# Altium project PCB_Project_IGNIS_v2_2.PrjPcb
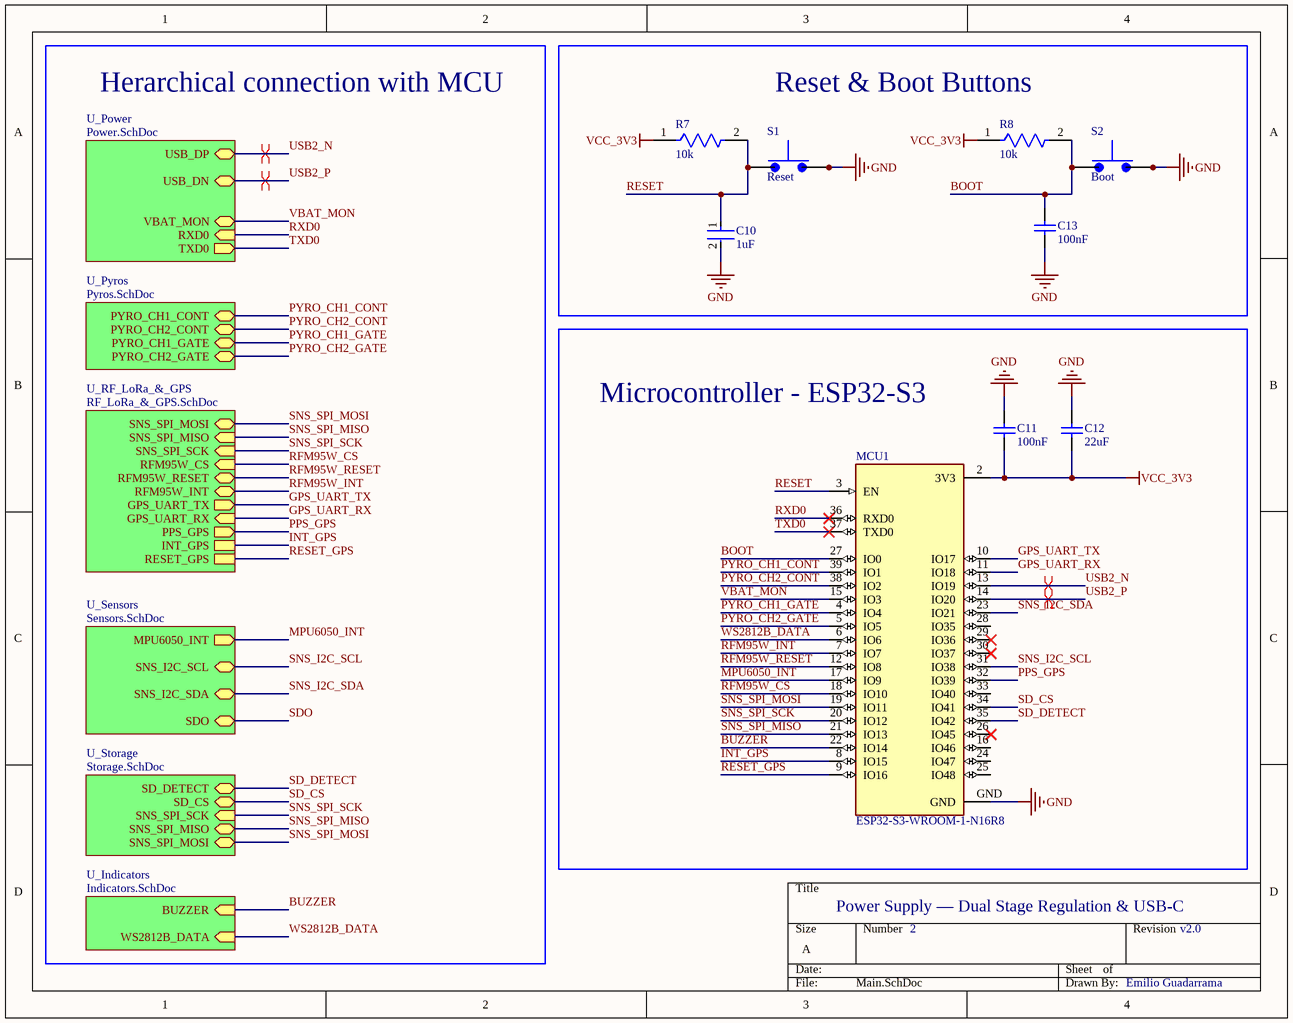
[diagram p0: Main.SchDoc]
7 sheets, 101 parts. Net scope: hierarchical (ports join the sheet entries above them; power ports are global).
Board file: PCB1_IGNIS_v2_2.PcbDoc
Sheets:
  Main.SchDoc
    U_Pyros = Pyros.SchDoc
    U_Storage = Storage.SchDoc
    U_Indicators = Indicators.SchDoc
    U_RF_LoRa_&_GPS = RF_LoRa_&_GPS.SchDoc
    U_Power = Power.SchDoc
    U_Sensors = Sensors.SchDoc

## Sheet Main.SchDoc
size A; SheetNumber: 1; SheetTotal: 7

### Parts
C10  1uF  [FP-0805-L_2_01_0_2-W_1_25-MFG]
C11  100nF  [CAPC2013X145X50NL20T25]
C12  22uF  [CAPC0805(2012)145_L]
C13  100nF  [CAPC2013X145X50NL20T25]
MCU1  ESP32-S3-WROOM-1-N16R8  [XCVR_ESP32-S3-WROOM-1-N16R2]
R7  10k  [FP-MCT0603-IPC_A]
R8  10k  [FP-MCT0603-IPC_A]
S1  Reset  [SW_SKRPABE010]
S2  Boot  [SW_SKRPABE010]

### Blocks framed on the sheet
Reset & Boot Buttons: C10 C13 R7 R8 S1 S2
Microcontroller - ESP32-S3: C11 C12 MCU1

### Sub-sheets
U_Indicators = Indicators.SchDoc: BUZZER (in), WS2812B_DATA (in)
U_Power = Power.SchDoc: RXD0 (in), TXD0 (out), VBAT_MON (bidir), USB_DP (bidir), USB_DN (bidir)
U_Pyros = Pyros.SchDoc: PYRO_CH2_CONT (bidir), PYRO_CH1_CONT (bidir), PYRO_CH2_GATE (bidir), PYRO_CH1_GATE (bidir)
U_RF_LoRa_&_GPS = RF_LoRa_&_GPS.SchDoc: SNS_SPI_MOSI (bidir), SNS_SPI_MISO (in), SNS_SPI_SCK (in), RFM95W_CS (in), RFM95W_RESET (bidir), RFM95W_INT (bidir), GPS_UART_TX (out), GPS_UART_RX (in), PPS_GPS (out), INT_GPS, RESET_GPS
U_Sensors = Sensors.SchDoc: MPU6050_INT (out), SNS_I2C_SCL (bidir), SNS_I2C_SDA (bidir), SDO (bidir)
U_Storage = Storage.SchDoc: SD_CS (bidir), SD_DETECT (bidir), SNS_SPI_MOSI (bidir), SNS_SPI_MISO (bidir), SNS_SPI_SCK (in)

### Nets
GND: C10.2 C11.2 C12.2 C13.1 MCU1.GND S1.3 S1.4 S2.3 S2.4
VCC_3V3: C11.1 C12.1 MCU1.2(3V3) R7.1 R8.1
BOOT: C13.2 MCU1.27(IO0) R8.2 S2.1 S2.2
BUZZER: MCU1.22(IO14) ; sheet U_Indicators/BUZZER
GPS_UART_RX: MCU1.11(IO18) ; sheet U_RF_LoRa_&_GPS/GPS_UART_RX
GPS_UART_TX: MCU1.10(IO17) ; sheet U_RF_LoRa_&_GPS/GPS_UART_TX
INT_GPS: MCU1.8(IO15) ; sheet U_RF_LoRa_&_GPS/INT_GPS
MPU6050_INT: MCU1.17(IO9) ; sheet U_Sensors/MPU6050_INT
PPS_GPS: MCU1.32(IO39) ; sheet U_RF_LoRa_&_GPS/PPS_GPS
PYRO_CH1_CONT: MCU1.39(IO1) ; sheet U_Pyros/PYRO_CH1_CONT
PYRO_CH1_GATE: MCU1.4(IO4) ; sheet U_Pyros/PYRO_CH1_GATE
PYRO_CH2_CONT: MCU1.38(IO2) ; sheet U_Pyros/PYRO_CH2_CONT
PYRO_CH2_GATE: MCU1.5(IO5) ; sheet U_Pyros/PYRO_CH2_GATE
RESET: C10.1 MCU1.3(EN) R7.2 S1.1 S1.2
RESET_GPS: MCU1.9(IO16) ; sheet U_RF_LoRa_&_GPS/RESET_GPS
RFM95W_CS: MCU1.18(IO10) ; sheet U_RF_LoRa_&_GPS/RFM95W_CS
RFM95W_INT: MCU1.7(IO7) ; sheet U_RF_LoRa_&_GPS/RFM95W_INT
RFM95W_RESET: MCU1.12(IO8) ; sheet U_RF_LoRa_&_GPS/RFM95W_RESET
RXD0: MCU1.36(RXD0) ; sheet U_Power/RXD0
SD_CS: MCU1.34(IO41) ; sheet U_Storage/SD_CS
SD_DETECT: MCU1.35(IO42) ; sheet U_Storage/SD_DETECT
SDO: sheet U_Sensors/SDO
SNS_I2C_SCL: MCU1.31(IO38) ; sheet U_Sensors/SNS_I2C_SCL
SNS_I2C_SDA: MCU1.23(IO21) ; sheet U_Sensors/SNS_I2C_SDA
SNS_SPI_MISO: MCU1.21(IO13) ; sheet U_Storage/SNS_SPI_MISO, sheet U_RF_LoRa_&_GPS/SNS_SPI_MISO
SNS_SPI_MOSI: MCU1.19(IO11) ; sheet U_Storage/SNS_SPI_MOSI, sheet U_RF_LoRa_&_GPS/SNS_SPI_MOSI
SNS_SPI_SCK: MCU1.20(IO12) ; sheet U_Storage/SNS_SPI_SCK, sheet U_RF_LoRa_&_GPS/SNS_SPI_SCK
TXD0: MCU1.37(TXD0) ; sheet U_Power/TXD0
USB2_N: MCU1.13(IO19) ; sheet U_Power/USB_DP
USB2_P: MCU1.14(IO20) ; sheet U_Power/USB_DN
VBAT_MON: MCU1.15(IO3) ; sheet U_Power/VBAT_MON
WS2812B_DATA: MCU1.6(IO6) ; sheet U_Indicators/WS2812B_DATA

Not connected (* = marked no-connect by the designer): MCU1 16(IO46) 24(IO47) 25(IO48) 26(IO45)* 28(IO35) 29(IO36)* 30(IO37)* 33(IO40)

### Layout directives
differential pair: USB2_N, USB2_P

### Notes on the sheet
- Herarchical connection with MCU
- Power Supply — Dual Stage Regulation & USB-C
- 2
- v2.0
- Emilio Guadarrama

### Library data of the parts
C10 = CMP-07738-122049624-1: 08051C105K4T2A Cap Ceramic 1uF 100V X7R 10% Pad SMD 0805 125C Automotive T/R; Capacitance: 1µF; Tolerance: 10%; Dielectric: X7R; Case/Package: 0805; Material: Ceramic; Height: 1.4mm; Voltage Rating (DC): 100V; Voltage Rating: 100V; Schedule B: 8532240020; NexarPartId: 122049624; RoHS: Compliant; Lifecycle Status: Production; Min Operating Temperature: -55°C; Max Operating Temperature: 125°C
C11 C13 = CMP-2007-01227-1: Manufacturer: Kemet; Part Number: C0805S104K5RACTU
C12 = CMP-1036-04938-1: CAP 22uF 6.3V ±10% 0805 (2012 Metric) Thickness 1.45mm SMD; Tolerance: Â±10%; Case-EIA: 0805; Case-Metric: 2012; Technology: SMT; Rated Voltage: 6.3 V; Max Thickness: 1.45 mm; Value: 22uF
MCU1 = ESP32-S3-WROOM-1-N16R2: Bluetooth, WiFi 802.11b/g/n, Bluetooth v5.0 Transceiver Module 2.4GHz PCB Trace Surface Mount; MF: Espressif Systems; MP: ESP32S3WROOM1N16R2; SnapEDA_Link: https://www.snapeda.com/parts/ESP32S3WROOM1N16R2/Espressif+Systems/view-part/?ref=snap; Package: NON STANDARD Espressif Systems; Value: *; Check_prices: https://www.snapeda.com/parts/ESP32S3WROOM1N16R2/Espressif+Systems/view-part/?ref=eda
R7 R8 = CMP-02407-011165-1: RES SMD 100 OHM 1% 1/8W 0603; Temperature Coefficient: 25ppm/°C; Resistance: 10kR; Power Rating: 125mW; Tolerance: 0.1%; Voltage Rating: 75V; Length: 1.55mm; Case Code (Imperial): 0603; Case/Package: 0603; Construction: Rectangular; Package Quantity: 1000; Number of Terminations: 2; Termination: SMD/SMT; Resistor Type: Thin Film; Features: Automotive AEC-Q200; Series: MCT 0603 - Precision; Max Operating Temperature: 155°C; Depth: 0.85mm; Max Power Dissipation: 125mW; Min Operating Temperature: -55°C; Width: 0.033inch; Case Code (Metric): 1608; Packaging: Tape and Reel; Weight: 6.7E-05oz; Military Standard: Not; Height: 0.022inch
S1 S2 = SKRPABE010: Switch Tactile N.O. SPST Button J-Bend 0.05A 16VDC 1.57N SMD Automotive T/R; MF: ALPS; SnapEDA_Link: https://www.snapeda.com/parts/SKRPABE010/ALPS/view-part/?ref=snap; Package: None; Value: *; MP: SKRPABE010; Check_prices: https://www.snapeda.com/parts/SKRPABE010/ALPS/view-part/?ref=eda

## Sheet Pyros.SchDoc
size A; SheetNumber: 6; SheetTotal: 7
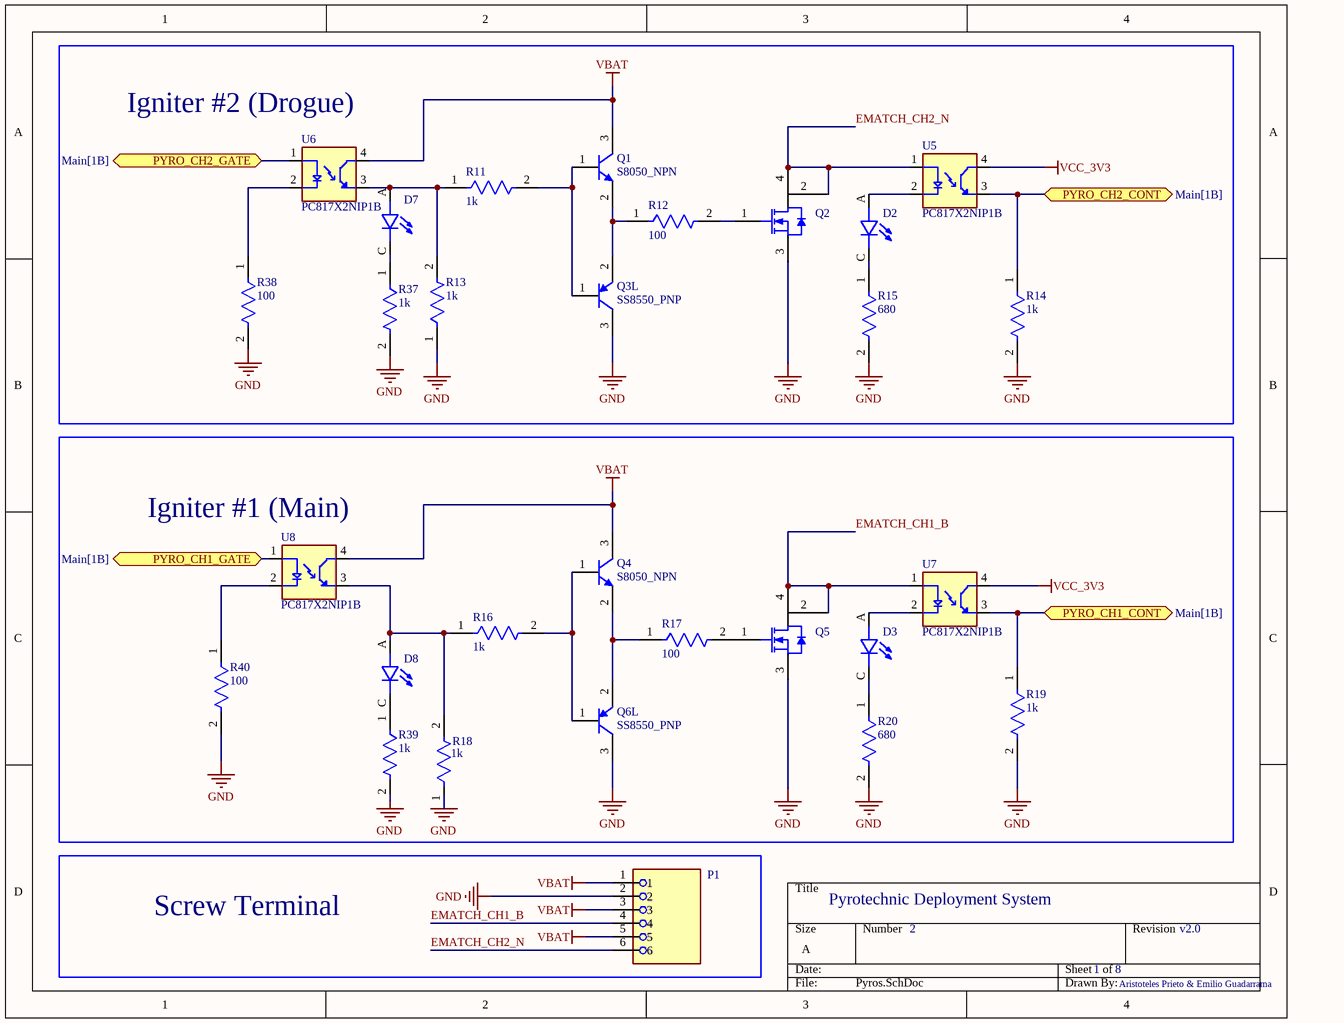
[diagram p1: Pyros.SchDoc]

### Parts
D2  SML-LXT0805IW-TR  [LEDC2012X120N]  (value not drawn)
D3  SML-LXT0805IW-TR  [LEDC2012X120N]  (value not drawn)
D7  SML-LXT0805IW-TR  [LEDC2012X120N]  (value not drawn)
D8  SML-LXT0805IW-TR  [LEDC2012X120N]  (value not drawn)
P1  1729160  [PHOENIX_1729160]  (value not drawn)
Q1  S8050_NPN  [PCBComponent_1]
Q2  NCE6005AR_Mosfet_N  [PCBComponent_1]  (value not drawn)
Q3  SS8550_PNP  [PCBComponent_1]  (part L of 12)
Q4  S8050_NPN  [PCBComponent_1]
Q5  NCE6005AR_Mosfet_N  [PCBComponent_1]  (value not drawn)
Q6  SS8550_PNP  [PCBComponent_1]  (part L of 12)
R11  1k  [FP-MCT0603-IPC_A]
R12  100  [FP-MCT0603-IPC_A]
R13  1k  [FP-MCT0603-IPC_A]
R14  1k  [FP-MCT0603-IPC_A]
R15  680  [FP-MCT0603-IPC_A]
R16  1k  [FP-MCT0603-IPC_A]
R17  100  [FP-MCT0603-IPC_A]
R18  1k  [FP-MCT0603-IPC_A]
R19  1k  [FP-MCT0603-IPC_A]
R20  680  [FP-MCT0603-IPC_A]
R37  1k  [FP-MCT0603-IPC_A]
R38  100  [FP-MCT0603-IPC_A]
R39  1k  [FP-MCT0603-IPC_A]
R40  100  [FP-MCT0603-IPC_A]
U5  PC817X2NIP1B  [SOIC254P960X420-4N]
U6  PC817X2NIP1B  [SOIC254P960X420-4N]
U7  PC817X2NIP1B  [SOIC254P960X420-4N]
U8  PC817X2NIP1B  [SOIC254P960X420-4N]

### Blocks framed on the sheet
Igniter #2 (Drogue): D2 D7 Q1-Q3 R11-R15 R37 R38 U5 U6
Igniter #1 (Main): D3 D8 Q4-Q6 R16-R20 R39 R40 U7 U8
Screw Terminal: P1

### Ports
PYRO_CH1_CONT (bidir, see Main[1B]), PYRO_CH1_GATE (bidir, see Main[1B]), PYRO_CH2_CONT (bidir, see Main[1B]), PYRO_CH2_GATE (bidir, see Main[1B])

### Nets
GND: P1.2 Q2.3(S) Q3.3(C) Q5.3(S) Q6.3(C) R13.1 R14.2 R15.2 R18.1 R19.2 R20.2 R37.2 R38.2 R39.2 R40.2
VBAT: P1.1 P1.3 P1.5 Q1.3(C) Q4.3(C) U6.4(CT) U8.4(CT)
VCC_3V3: U5.4(CT) U7.4(CT)
EMATCH_CH1_B: P1.4 Q5.2(D) Q5.4(D) U7.1(A)
EMATCH_CH2_N: P1.6 Q2.2(D) Q2.4(D) U5.1(A)
PYRO_CH1_CONT: R19.1 U7.3(ET) ; port PYRO_CH1_CONT
PYRO_CH1_GATE: U8.1(A) ; port PYRO_CH1_GATE
PYRO_CH2_CONT: R14.1 U5.3(ET) ; port PYRO_CH2_CONT
PYRO_CH2_GATE: U6.1(A) ; port PYRO_CH2_GATE
NetD2_A: D2.A U5.2(C)
NetD2_C: D2.C R15.1
NetD3_A: D3.A U7.2(C)
NetD3_C: D3.C R20.1
NetD7_A: D7.A R11.1 R13.2 U6.3(ET)
NetD7_C: D7.C R37.1
NetD8_A: D8.A R16.1 R18.2 U8.3(ET)
NetD8_C: D8.C R39.1
NetQ1_1: Q1.1(B) Q3.1(B) R11.2
NetQ1_2: Q1.2(E) Q3.2(E) R12.1
NetQ2_1: Q2.1(G) R12.2
NetQ4_1: Q4.1(B) Q6.1(B) R16.2
NetQ4_2: Q4.2(E) Q6.2(E) R17.1
NetQ5_1: Q5.1(G) R17.2
NetR38_1: R38.1 U6.2(C)
NetR40_1: R40.1 U8.2(C)

### Notes on the sheet
- Pyrotechnic Deployment System
- 2
- 1
- 8
- v2.0
- Aristoteles Prieto & Emilio Guadarrama

### Library data of the parts
D2 D3 D7 D8 = SML-LXT0805IW-TR: LED;Red;11mcd;0.061In.Dia.;SMD;100mA;2V Vf;635nm;140deg;SMD;White Diffused;5V Vr | Lumex SML-LXT0805IW-TR; MF: Lumex Opto/Components; SnapEDA_Link: https://www.snapeda.com/parts/SML-LXT0805IW-TR/Lumex+Opto%252FComponents+Inc./view-part/?ref=snap; Package: 0805 Lumex; Value: *; MP: SML-LXT0805IW-TR; Check_prices: https://www.snapeda.com/parts/SML-LXT0805IW-TR/Lumex+Opto%252FComponents+Inc./view-part/?ref=eda
P1 = 1729160: PCB Terminal Screw 5.08mm 16AWG 400V 13.5A 6 Position COMBICON MKDSN Series | Phoenix Contact 1729160; SnapEDA_Link: https://www.snapeda.com/parts/1729160/Phoenix+Contact/view-part/?ref=snap; Package: None; Value: *; MF: Phoenix Contact; MP: 1729160; Check_prices: https://www.snapeda.com/parts/1729160/Phoenix+Contact/view-part/?ref=eda
Q1 Q3 Q4 Q6 = Component_1
Q2 Q5 = NCE6005AR
R11 R13 R14 R16 R18 R19 = CMP-02407-011165-1: RES SMD 100 OHM 1% 1/8W 0603; Temperature Coefficient: 25ppm/°C; Resistance: 1kR; Power Rating: 125mW; Tolerance: 0.1%; Voltage Rating: 75V; Length: 1.55mm; Case Code (Imperial): 0603; Case/Package: 0603; Construction: Rectangular; Package Quantity: 1000; Number of Terminations: 2; Termination: SMD/SMT; Resistor Type: Thin Film; Features: Automotive AEC-Q200; Series: MCT 0603 - Precision; Max Operating Temperature: 155°C; Depth: 0.85mm; Max Power Dissipation: 125mW; Min Operating Temperature: -55°C; Width: 0.033inch; Case Code (Metric): 1608; Packaging: Tape and Reel; Weight: 6.7E-05oz; Military Standard: Not; Height: 0.022inch
R12 R17 = CMP-02407-011165-1: RES SMD 100 OHM 1% 1/8W 0603; Temperature Coefficient: 25ppm/°C; Resistance: 100R; Power Rating: 125mW; Tolerance: 0.1%; Voltage Rating: 75V; Length: 1.55mm; Case Code (Imperial): 0603; Case/Package: 0603; Construction: Rectangular; Package Quantity: 1000; Number of Terminations: 2; Termination: SMD/SMT; Resistor Type: Thin Film; Features: Automotive AEC-Q200; Series: MCT 0603 - Precision; Max Operating Temperature: 155°C; Depth: 0.85mm; Max Power Dissipation: 125mW; Min Operating Temperature: -55°C; Width: 0.033inch; Case Code (Metric): 1608; Packaging: Tape and Reel; Weight: 6.7E-05oz; Military Standard: Not; Height: 0.022inch
R15 R20 = CMP-02407-011165-1: RES SMD 100 OHM 1% 1/8W 0603; Temperature Coefficient: 25ppm/°C; Resistance: 680R; Power Rating: 125mW; Tolerance: 0.1%; Voltage Rating: 75V; Length: 1.55mm; Case Code (Imperial): 0603; Case/Package: 0603; Construction: Rectangular; Package Quantity: 1000; Number of Terminations: 2; Termination: SMD/SMT; Resistor Type: Thin Film; Features: Automotive AEC-Q200; Series: MCT 0603 - Precision; Max Operating Temperature: 155°C; Depth: 0.85mm; Max Power Dissipation: 125mW; Min Operating Temperature: -55°C; Width: 0.033inch; Case Code (Metric): 1608; Packaging: Tape and Reel; Weight: 6.7E-05oz; Military Standard: Not; Height: 0.022inch
R37-R40 = CMP-02407-011165-1: RES SMD 100 OHM 1% 1/8W 0603; Temperature Coefficient: 25ppm/°C; Resistance: 150R; Power Rating: 125mW; Tolerance: 0.1%; Voltage Rating: 75V; Length: 1.55mm; Case Code (Imperial): 0603; Case/Package: 0603; Construction: Rectangular; Package Quantity: 1000; Number of Terminations: 2; Termination: SMD/SMT; Resistor Type: Thin Film; Features: Automotive AEC-Q200; Series: MCT 0603 - Precision; Max Operating Temperature: 155°C; Depth: 0.85mm; Max Power Dissipation: 125mW; Min Operating Temperature: -55°C; Width: 0.033inch; Case Code (Metric): 1608; Packaging: Tape and Reel; Weight: 6.7E-05oz; Military Standard: Not; Height: 0.022inch
U5-U8 = PC817X2NIP1B: Optocoupler DC-IN 1-CH Transistor DC-OUT 4-Pin DIP SMD T/R; MF: Sharp Microelectronics; SnapEDA_Link: https://www.snapeda.com/parts/PC817X2NIP1B/Sharp+Microelectronics/view-part/?ref=snap; Package: SMD-4 Sharp Microelectronics; Value: *; MP: PC817X2NIP1B; Check_prices: https://www.snapeda.com/parts/PC817X2NIP1B/Sharp+Microelectronics/view-part/?ref=eda

## Sheet Storage.SchDoc
size A; SheetNumber: 5; SheetTotal: 7
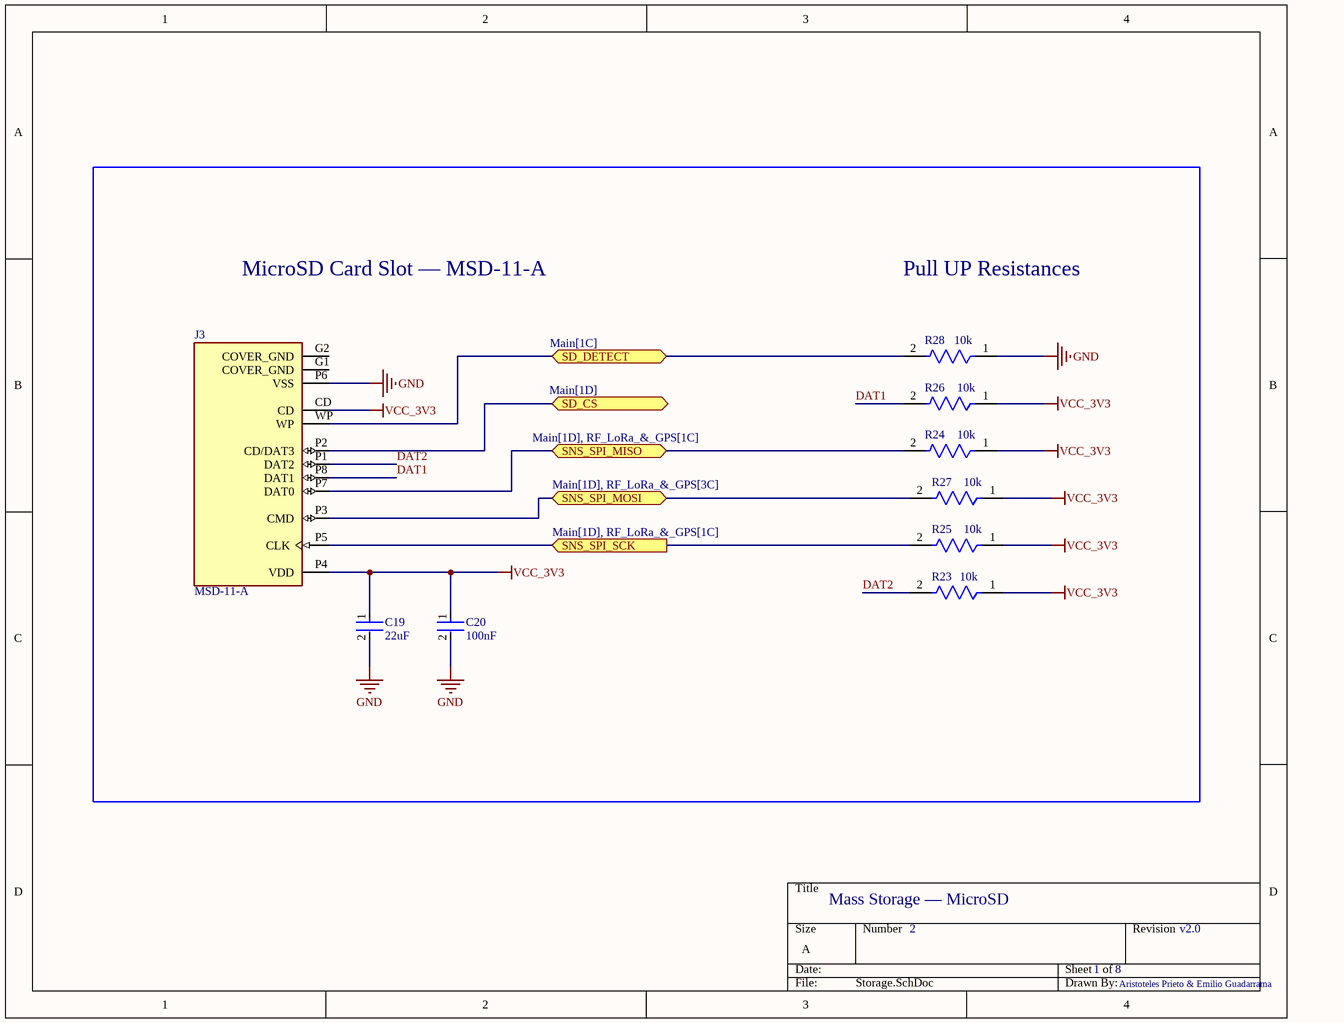
[diagram p2: Storage.SchDoc]

### Parts
C19  22uF  [FP-C0805C-DN-MFG]
C20  100nF  [FP-C0805C-DN-MFG]
J3  MSD-11-A  [CUI_MSD-11-A]
R23  10k  [FP-MCT0603-IPC_A]
R24  10k  [FP-MCT0603-IPC_A]
R25  10k  [FP-MCT0603-IPC_A]
R26  10k  [FP-MCT0603-IPC_A]
R27  10k  [FP-MCT0603-IPC_A]
R28  10k  [FP-MCT0603-IPC_A]

### Ports
SD_CS (bidir, see Main[1D]), SD_DETECT (bidir, see Main[1C]), SNS_SPI_MISO (bidir, see Main[1D], RF_LoRa_&_GPS[1C]), SNS_SPI_MOSI (bidir, see Main[1D], RF_LoRa_&_GPS[3C]), SNS_SPI_SCK (in, see Main[1D], RF_LoRa_&_GPS[1C])

### Nets
GND: C19.2 C20.2 J3.P6(VSS) R28.1
VCC_3V3: C19.1 C20.1 J3.CD J3.P4(VDD) R23.1 R24.1 R25.1 R26.1 R27.1
DAT1: J3.P8(DAT1) R26.2
DAT2: J3.P1(DAT2) R23.2
SD_CS: J3.P2(CD/DAT3) ; port SD_CS
SD_DETECT: J3.WP R28.2 ; port SD_DETECT
SNS_SPI_MISO: J3.P7(DAT0) R24.2 ; port SNS_SPI_MISO
SNS_SPI_MOSI: J3.P3(CMD) R27.2 ; port SNS_SPI_MOSI
SNS_SPI_SCK: J3.P5(CLK) R25.2 ; port SNS_SPI_SCK

Not connected (* = marked no-connect by the designer): J3 G1(COVER_GND) G2(COVER_GND)

### Notes on the sheet
- MicroSD Card Slot — MSD-11-A
- Pull UP Resistances
- Mass Storage — MicroSD
- 2
- 1
- 8
- v2.0
- Aristoteles Prieto & Emilio Guadarrama

### Library data of the parts
C19 C20 = CMP-2007-00279-2: CAP CER 0.1UF 50V X7R 0805; Manufacturer Part Number: C0805C104K5RACTU; Manufacturer: KEMET; Value: 0.10 μF; Tolerance: 0.1; Temperature Coefficient: 30ppm/°C; Material: Ceramic; Device Class L2: Capacitors; Temperature Range Low: -55°C; Voltage Rating: 50 V; Digikey Description: CAP CER 0.1UF 50V X7R 0805; Category: Cap; ComponentLink2Description: Datasheet; Octopart: https://octopart.com/c0805c104k5ractu-kemet-143926; RoHS: TRUE; ComponentLink2URL: https://content.kemet.com/datasheets/KEM_C1003_C0G_SMD.pdf; Temperature Characteristic: X7R; Temperature: -55°C to +125°C; Height: 0.88mm; Temperature Range High: +125°C; Device Class L1: Passive Components; Automotive: No; Lead Free: Yes; Ipc Land Pattern Name: CAPC200125X78; Device Class L3: Ceramic Capacitors; Mouser Description: Cap Ceramic 0.1uF 50V X7R 10% SMD 2.0 x 1.2 mm 125 C Paper T/R; Capacitance: 0.10 μF; Package: C0805C-DN
J3 = MSD-11-A: Micro SD Card Connector, 8 Positions, Connector and Ejector, Push In, Auto Eject Out, Surface Mount, 1.85 mm Heaight Above Board, Gold Flash; MF: Same Sky; SnapEDA_Link: https://www.snapeda.com/parts/MSD-11-A/Same+Sky/view-part/?ref=snap; Package: None; Value: *; MP: MSD-11-A; Check_prices: https://www.snapeda.com/parts/MSD-11-A/Same+Sky/view-part/?ref=eda
R23-R28 = CMP-02407-011165-1: RES SMD 100 OHM 1% 1/8W 0603; Temperature Coefficient: 25ppm/°C; Resistance: 20kR; Power Rating: 125mW; Tolerance: 0.1%; Voltage Rating: 75V; Length: 1.55mm; Case Code (Imperial): 0603; Case/Package: 0603; Construction: Rectangular; Package Quantity: 1000; Number of Terminations: 2; Termination: SMD/SMT; Resistor Type: Thin Film; Features: Automotive AEC-Q200; Series: MCT 0603 - Precision; Max Operating Temperature: 155°C; Depth: 0.85mm; Max Power Dissipation: 125mW; Min Operating Temperature: -55°C; Width: 0.033inch; Case Code (Metric): 1608; Packaging: Tape and Reel; Weight: 6.7E-05oz; Military Standard: Not; Height: 0.022inch

## Sheet Indicators.SchDoc
size A; SheetNumber: 7; SheetTotal: 7
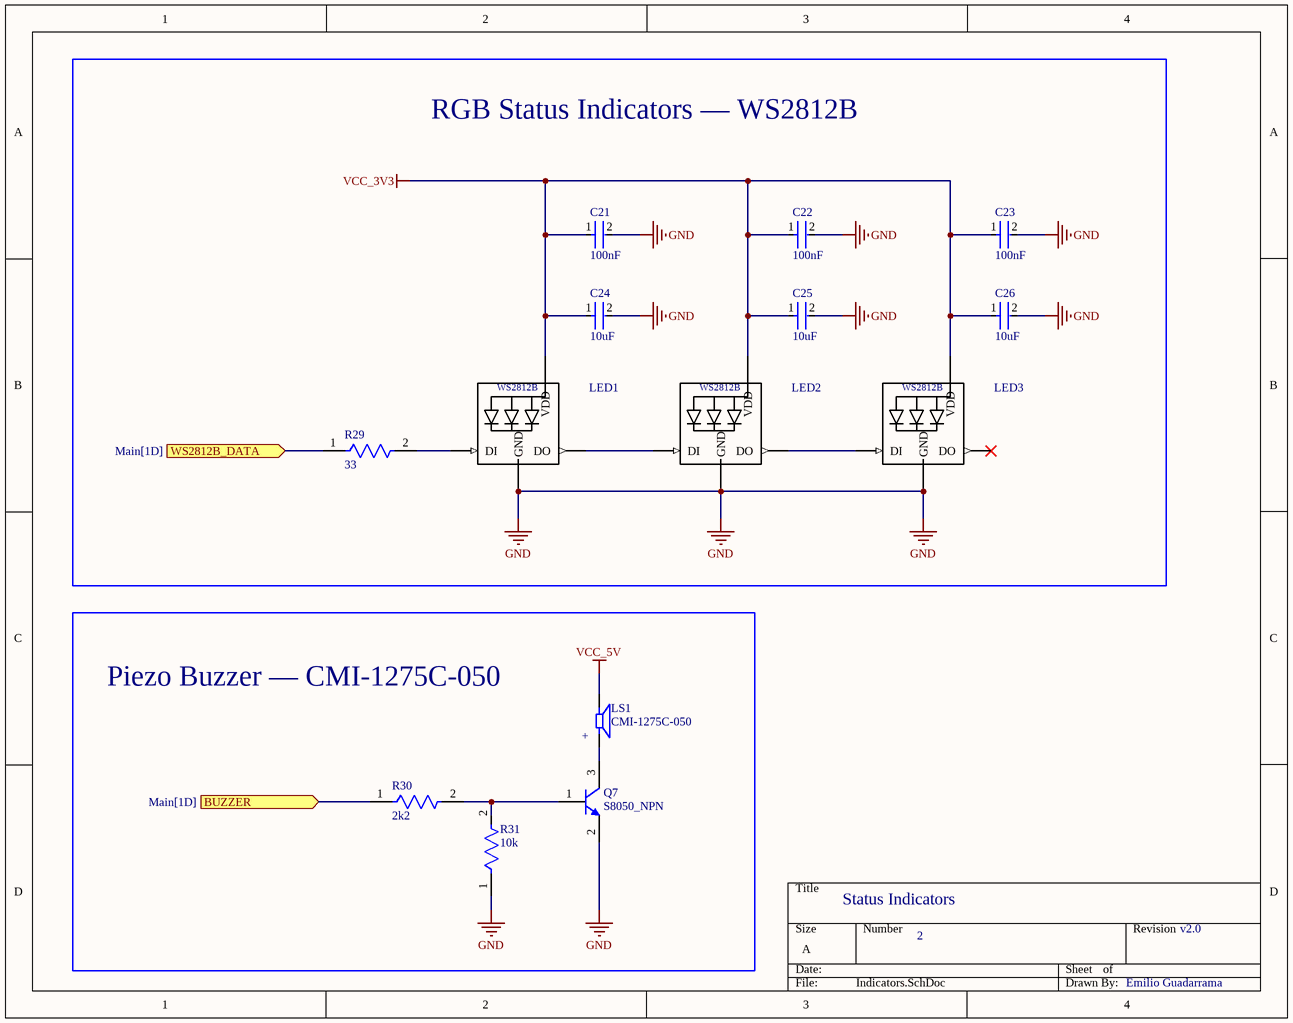
[diagram p3: Indicators.SchDoc]

### Parts
C21  100nF  [FP-C0805C-DN-MFG]
C22  100nF  [FP-C0805C-DN-MFG]
C23  100nF  [FP-C0805C-DN-MFG]
C24  10uF  [FP-C0805C-DN-MFG]
C25  10uF  [FP-C0805C-DN-MFG]
C26  10uF  [FP-C0805C-DN-MFG]
LED1  WS2812B  [*WS2812B_WS2812B(Primary)]  (value not drawn)
LED2  WS2812B  [*WS2812B_WS2812B(Primary)]  (value not drawn)
LED3  WS2812B  [*WS2812B_WS2812B(Primary)]  (value not drawn)
LS1  CMI-1275C-050  [CUI_CMI-1275C-050]
Q7  S8050_NPN  [PCBComponent_1]
R29  33  [FP-MCT0603-IPC_A]
R30  2k2  [FP-MCT0603-IPC_A]
R31  10k  [FP-MCT0603-IPC_A]

### Blocks framed on the sheet
RGB Status Indicators — WS2812B: C21-C26 LED1-LED3 R29
Piezo Buzzer — CMI-1275C-050: LS1 Q7 R30 R31

### Ports
BUZZER (in, see Main[1D]), WS2812B_DATA (in, see Main[1D])

### Nets
GND: C21.2 C22.2 C23.2 C24.2 C25.2 C26.2 LED1.3-GND(GND) LED2.3-GND(GND) LED3.3-GND(GND) Q7.2(E) R31.1
VCC_3V3: C21.1 C22.1 C23.1 C24.1 C25.1 C26.1 LED1.1-VDD(VDD) LED2.1-VDD(VDD) LED3.1-VDD(VDD)
VCC_5V: LS1.N
BUZZER: R30.1 ; port BUZZER
WS2812B_DATA: R29.1 ; port WS2812B_DATA
NetLED1_2-DOUT: LED1.2-DOUT(DO) LED2.4-DIN(DI)
NetLED1_4-DIN: LED1.4-DIN(DI) R29.2
NetLED2_2-DOUT: LED2.2-DOUT(DO) LED3.4-DIN(DI)
NetLS1_P: LS1.P Q7.3(C)
NetQ7_1: Q7.1(B) R30.2 R31.2

Not connected (* = marked no-connect by the designer): LED3 2-DOUT(DO)*

### Notes on the sheet
- Status Indicators
- 2
- v2.0
- Emilio Guadarrama
- (in symbol CMI-1275C-050) +

### Library data of the parts
C21-C26 = CMP-2007-00279-2: as C19 on sheet Storage; Device Class L2: Capacitors; Temperature Range Low: -55°C; Voltage Rating: 50 V; Digikey Description: CAP CER 0.1UF 50V X7R 0805; Category: Cap; ComponentLink2Description: Datasheet; Octopart: https://octopart.com/c0805c104k5ractu-kemet-143926; RoHS: TRUE; ComponentLink2URL: https://content.kemet.com/datasheets/KEM_C1003_C0G_SMD.pdf; Temperature Characteristic: X7R; Temperature: -55°C to +125°C; Height: 0.88mm; Temperature Range High: +125°C; Device Class L1: Passive Components; Automotive: No; Lead Free: Yes; Ipc Land Pattern Name: CAPC200125X78; Device Class L3: Ceramic Capacitors; Mouser Description: Cap Ceramic 0.1uF 50V X7R 10% SMD 2.0 x 1.2 mm 125 C Paper T/R; Capacitance: 0.10 μF; Package: C0805C-DN
LED1-LED3 = WS2812B: Intelligent control LED integrated light source; MF: Worldsemi; SnapEDA_Link: https://www.snapeda.com/parts/WS2812B/Worldsemi/view-part/?ref=snap; Package: None; MP: WS2812B; Check_prices: https://www.snapeda.com/parts/WS2812B/Worldsemi/view-part/?ref=eda; Value: *
LS1 = CMI-1275C-050: 12 mm, 5 Vdc, 90 dB, 3.1 kHz, Through Hole, Magnetic Audio Indicator Buzzer; MF: Same Sky; SnapEDA_Link: https://www.snapeda.com/parts/CMI-1275C-050/Same+Sky/view-part/?ref=snap; Package: None; Value: *; MP: CMI-1275C-050; Check_prices: https://www.snapeda.com/parts/CMI-1275C-050/Same+Sky/view-part/?ref=eda
Q7 = Component_1
R29-R31 = CMP-02407-011165-1: as R23 on sheet Storage; Length: 1.55mm; Case Code (Imperial): 0603; Case/Package: 0603; Construction: Rectangular; Package Quantity: 1000; Number of Terminations: 2; Termination: SMD/SMT; Resistor Type: Thin Film; Features: Automotive AEC-Q200; Series: MCT 0603 - Precision; Max Operating Temperature: 155°C; Depth: 0.85mm; Max Power Dissipation: 125mW; Min Operating Temperature: -55°C; Width: 0.033inch; Case Code (Metric): 1608; Packaging: Tape and Reel; Weight: 6.7E-05oz; Military Standard: Not; Height: 0.022inch

## Sheet RF_LoRa_&_GPS.SchDoc
size A; SheetNumber: 3; SheetTotal: 7
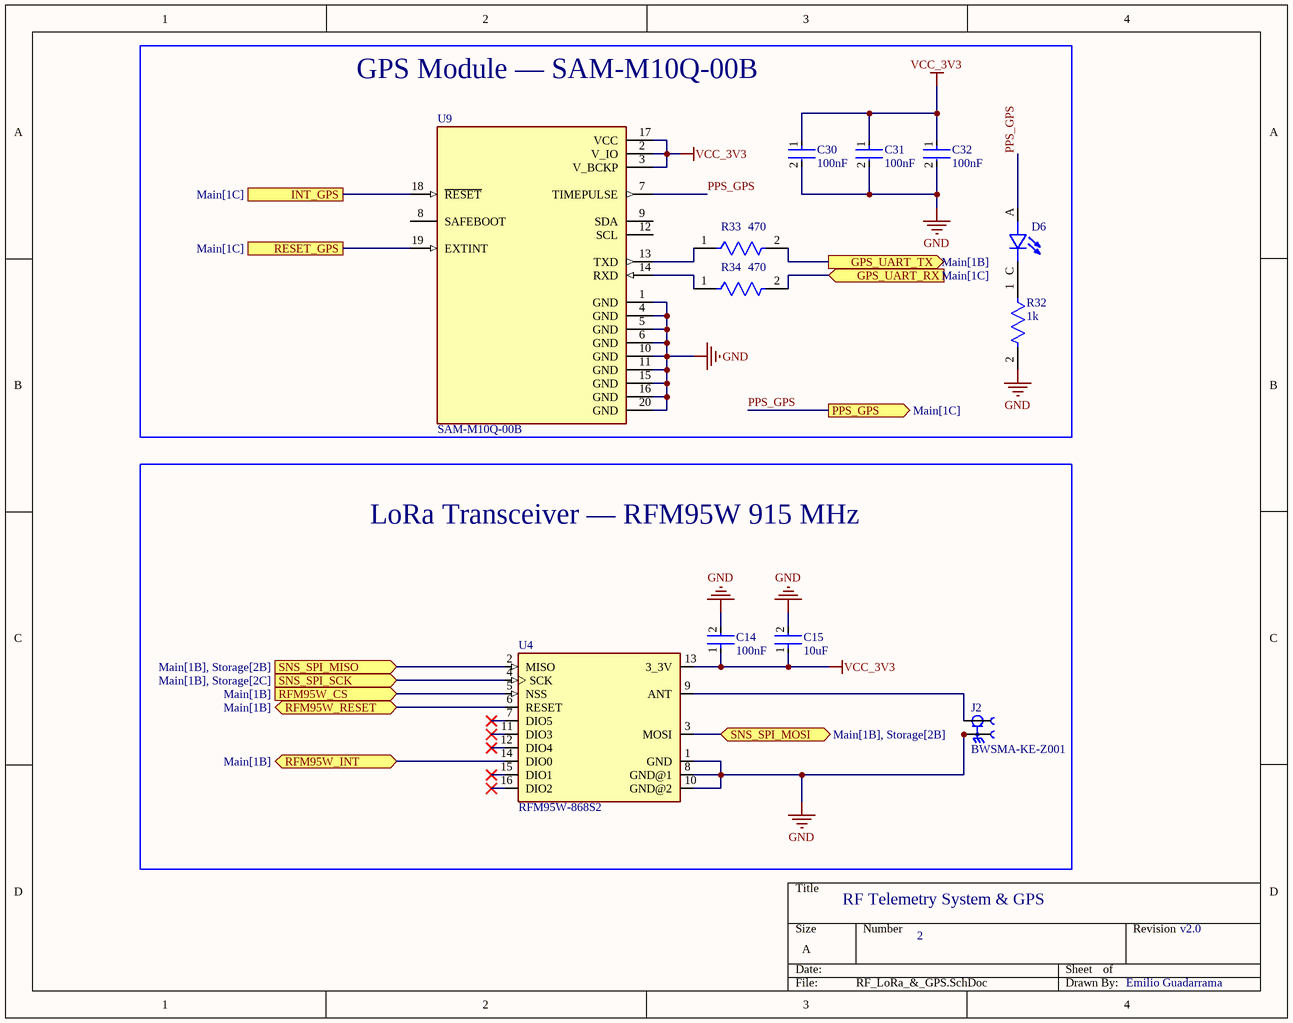
[diagram p4: RF_LoRa_&_GPS.SchDoc]

### Parts
(Parts that share a designator on the sheet are numbered #1, #2 ... from top to bottom, then left to right.)
C14  100nF  [FP-C0805C-DN-MFG]
C15  10uF  [FP-C0805C-DN-MFG]
C30  100nF  [FP-C0805C-DN-MFG]
C31  100nF  [FP-C0805C-DN-MFG]
C32  100nF  [FP-C0805C-DN-MFG]
D6  SML-LXT0805IW-TR  [LEDC2012X120N]  (value not drawn)
J2  BWSMA-KE-Z001  [BAT_WIRELESS_BWSMA-KE-Z001]
R32#1  1k  [FP-MCT0603-IPC_A]
R33  470  [FP-MCT0603-IPC_A]
R34  470  [FP-MCT0603-IPC_A]
U4  RFM95W-868S2  [XCVR_RFM95W-868S2]
U9  SAM-M10Q-00B  [XCVR_SAM-M10Q-00B]

### Blocks framed on the sheet
GPS Module — SAM-M10Q-00B: C30-C32 D6 R32#1 R33 R34 U9
LoRa Transceiver — RFM95W 915 MHz: C14 C15 J2 U4

### Ports
GPS_UART_RX (in, see Main[1C]), GPS_UART_TX (out, see Main[1B]), INT_GPS (see Main[1C]), PPS_GPS (out, see Main[1C]), RESET_GPS (see Main[1C]), RFM95W_CS (in, see Main[1B]), RFM95W_INT (bidir, see Main[1B]), RFM95W_RESET (bidir, see Main[1B]), SNS_SPI_MISO (in, see Main[1B], Storage[2B]), SNS_SPI_MOSI (bidir, see Main[1B], Storage[2B]), SNS_SPI_SCK (in, see Main[1B], Storage[2C])

### Nets
GND: C14.2 C15.2 C30.2 C31.2 C32.2 J2.2_1 J2.2_2 J2.2_3 J2.2_4 R32#1.2 U4.1(GND) U4.8(GND@1) U4.10(GND@2) U9.1(GND) U9.4(GND) U9.5(GND) U9.6(GND) U9.10(GND) U9.11(GND) U9.15(GND) U9.16(GND) U9.20(GND)
VCC_3V3: C14.1 C15.1 C30.1 C31.1 C32.1 U4.13(3_3V) U9.2(V_IO) U9.3(V_BCKP) U9.17(VCC)
GPS_UART_RX: R34.2 ; port GPS_UART_RX
GPS_UART_TX: R33.2 ; port GPS_UART_TX
INT_GPS: U9.18(~{RESET}) ; port INT_GPS
PPS_GPS: D6.A U9.7(TIMEPULSE) ; port PPS_GPS
RESET_GPS: U9.19(EXTINT) ; port RESET_GPS
RFM95W_CS: U4.5(NSS) ; port RFM95W_CS
RFM95W_INT: U4.14(DIO0) ; port RFM95W_INT
RFM95W_RESET: U4.6(RESET) ; port RFM95W_RESET
SNS_SPI_MISO: U4.2(MISO) ; port SNS_SPI_MISO
SNS_SPI_MOSI: U4.3(MOSI) ; port SNS_SPI_MOSI
SNS_SPI_SCK: U4.4(SCK) ; port SNS_SPI_SCK
NetD6_C: D6.C R32#1.1
NetJ2_1: J2.1 U4.9(ANT)
NetR33_1: R33.1 U9.13(TXD)
NetR34_1: R34.1 U9.14(RXD)

Not connected (* = marked no-connect by the designer): U4 7(DIO5)* 11(DIO3)* 12(DIO4)* 15(DIO1)* 16(DIO2)*; U9 8(SAFEBOOT) 9(SDA) 12(SCL)

### Notes on the sheet
- RF Telemetry System & GPS
- 2
- v2.0
- Emilio Guadarrama

### Library data of the parts
C14 C15 C30-C32 = CMP-2007-00279-2: CAP CER 0.1UF 50V X7R 0805; Manufacturer Part Number: C0805C104K5RACTU; Manufacturer: KEMET; Tolerance: 0.1; Temperature Coefficient: 30ppm/°C; Material: Ceramic; Device Class L2: Capacitors; Temperature Range Low: -55°C; Voltage Rating: 50 V; Digikey Description: CAP CER 0.1UF 50V X7R 0805; Category: Cap; ComponentLink2Description: Datasheet; Octopart: https://octopart.com/c0805c104k5ractu-kemet-143926; RoHS: TRUE; ComponentLink2URL: https://content.kemet.com/datasheets/KEM_C1003_C0G_SMD.pdf; Temperature Characteristic: X7R; Temperature: -55°C to +125°C; Height: 0.88mm; Temperature Range High: +125°C; Device Class L1: Passive Components; Automotive: No; Lead Free: Yes; Ipc Land Pattern Name: CAPC200125X78; Device Class L3: Ceramic Capacitors; Mouser Description: Cap Ceramic 0.1uF 50V X7R 10% SMD 2.0 x 1.2 mm 125 C Paper T/R; Package: C0805C-DN
  C14 C30-C32: Value: 100 nF; Capacitance: 100 nF
  C15: Value: 10 uF; Capacitance: 10 uF
D6 = SML-LXT0805IW-TR: as D2 on sheet Pyros; SnapEDA_Link: https://www.snapeda.com/parts/SML-LXT0805IW-TR/Lumex+Opto%252FComponents+Inc./view-part/?ref=snap; Package: 0805 Lumex; Value: *; MP: SML-LXT0805IW-TR; Check_prices: https://www.snapeda.com/parts/SML-LXT0805IW-TR/Lumex+Opto%252FComponents+Inc./view-part/?ref=eda
J2 = BWSMA-KE-Z001: 1 Inner bore SMA Board Edge Positive foot -65â„ƒ~+165â„ƒ 50Î© Plugin RF Connectors / Coaxial Connectors ROHS; MF: Bat Wireless; SnapEDA_Link: https://www.snapeda.com/parts/BWSMA-KE-Z001/Bat+Wireless/view-part/?ref=snap; Package: None; Value: *; MP: BWSMA-KE-Z001; Check_prices: https://www.snapeda.com/parts/BWSMA-KE-Z001/Bat+Wireless/view-part/?ref=eda
R32#1 = CMP-02407-011165-1: as R11 on sheet Pyros; Length: 1.55mm; Case Code (Imperial): 0603; Case/Package: 0603; Construction: Rectangular; Package Quantity: 1000; Number of Terminations: 2; Termination: SMD/SMT; Resistor Type: Thin Film; Features: Automotive AEC-Q200; Series: MCT 0603 - Precision; Max Operating Temperature: 155°C; Depth: 0.85mm; Max Power Dissipation: 125mW; Min Operating Temperature: -55°C; Width: 0.033inch; Case Code (Metric): 1608; Packaging: Tape and Reel; Weight: 6.7E-05oz; Military Standard: Not; Height: 0.022inch
R33 R34 = CMP-02407-011165-1: RES SMD 100 OHM 1% 1/8W 0603; Temperature Coefficient: 25ppm/°C; Resistance: 470R; Power Rating: 125mW; Tolerance: 0.1%; Voltage Rating: 75V; Length: 1.55mm; Case Code (Imperial): 0603; Case/Package: 0603; Construction: Rectangular; Package Quantity: 1000; Number of Terminations: 2; Termination: SMD/SMT; Resistor Type: Thin Film; Features: Automotive AEC-Q200; Series: MCT 0603 - Precision; Max Operating Temperature: 155°C; Depth: 0.85mm; Max Power Dissipation: 125mW; Min Operating Temperature: -55°C; Width: 0.033inch; Case Code (Metric): 1608; Packaging: Tape and Reel; Weight: 6.7E-05oz; Military Standard: Not; Height: 0.022inch
U4 = RFM95W-868S2: General ISM < 1GHz LoRaâ„¢ Transceiver Module 868MHz Antenna Not Included Surface Mount; MF: RF; Package: Non Standard RF Solutions; Price: None; Check_prices: https://www.snapeda.com/parts/RFM95W-868S2/RF+Solutions/view-part/?ref=eda; Value: *; SnapEDA_Link: https://www.snapeda.com/parts/RFM95W-868S2/RF+Solutions/view-part/?ref=snap; MP: RFM95W-868S2; Availability: In Stock; Purchase-URL: https://pricing.snapeda.com/search?q=RFM95W-868S2&ref=eda
U9 = SAM-M10Q-00B: - RF Receiver Galileo, GLONASS, GPS 1.575GHz, 1.602GHz -165dBm 400kbps On-Board, Patch Module; MF: u-blox; SnapEDA_Link: https://www.snapeda.com/parts/SAM-M10Q-00B/u-blox/view-part/?ref=snap; Package: None; Value: *; MP: SAM-M10Q-00B; Check_prices: https://www.snapeda.com/parts/SAM-M10Q-00B/u-blox/view-part/?ref=eda

## Sheet Power.SchDoc
size A; SheetNumber: 2; SheetTotal: 7
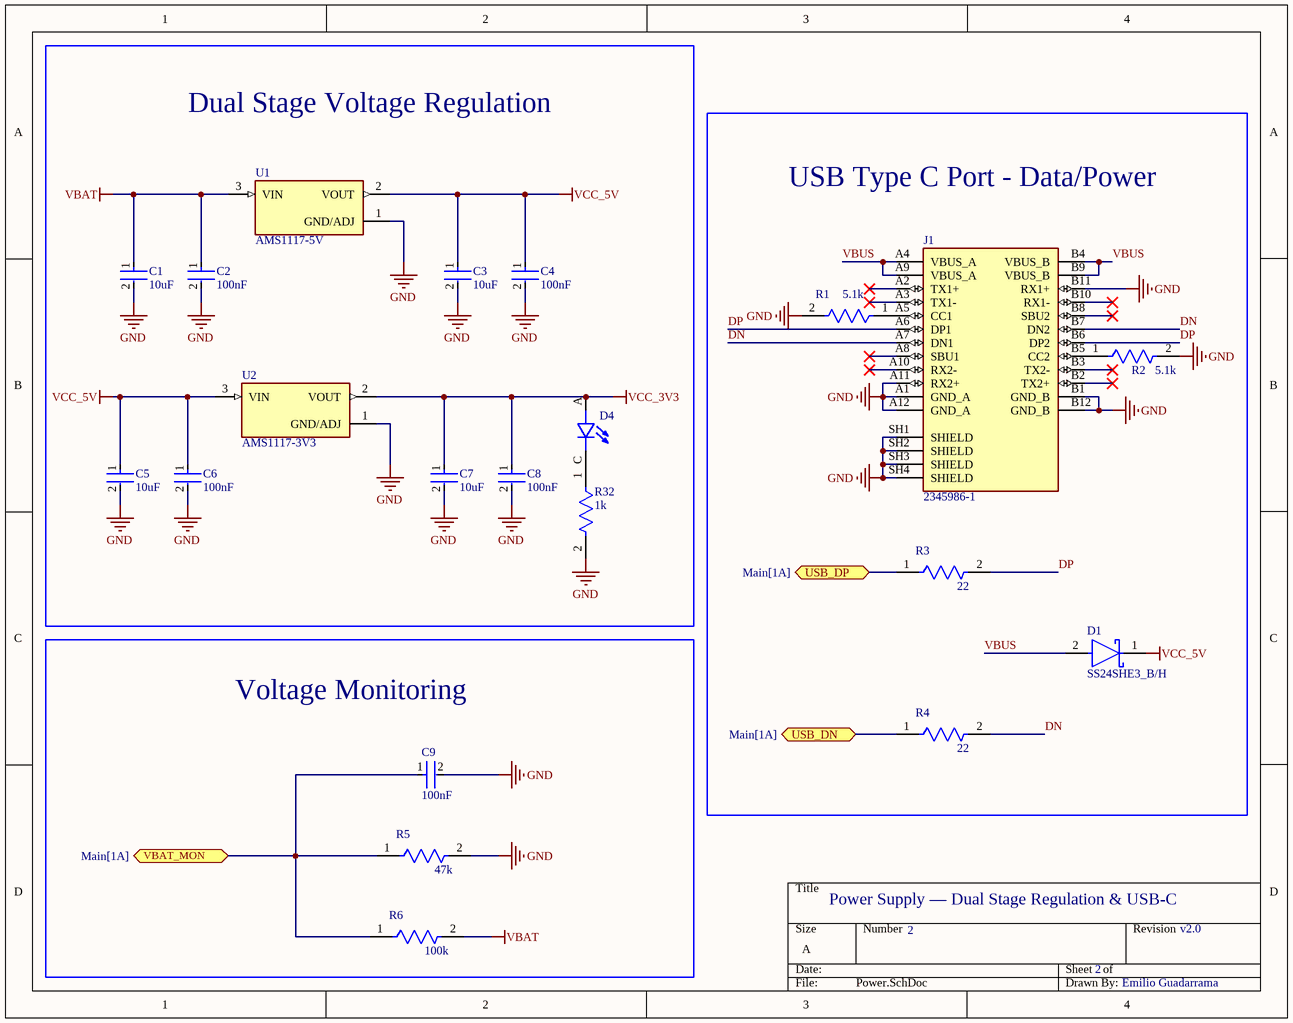
[diagram p5: Power.SchDoc]

### Parts
(Parts that share a designator on the sheet are numbered #1, #2 ... from top to bottom, then left to right.)
C1  10uF  [FP-C0805C-DN-MFG]
C2  100nF  [FP-C0805C-DN-MFG]
C3  10uF  [FP-C0805C-DN-MFG]
C4  100nF  [FP-C0805C-DN-MFG]
C5  10uF  [FP-C0805C-DN-MFG]
C6  100nF  [FP-C0805C-DN-MFG]
C7  10uF  [FP-C0805C-DN-MFG]
C8  100nF  [FP-C0805C-DN-MFG]
C9  100nF  [FP-C0805C-DN-MFG]
D1  SS24SHE3_B/H  [FP-95400-MFG]
D4  SML-LXT0805IW-TR  [LEDC2012X120N]  (value not drawn)
J1  2345986-1  [TE_2345986-1]
R1  5.1k  [FP-MCT0603-IPC_A]
R2  5.1k  [FP-MCT0603-IPC_A]
R3  22  [FP-MCT0603-IPC_A]
R4  22  [FP-MCT0603-IPC_A]
R5  47k  [FP-MCT0603-IPC_A]
R6  100k  [FP-MCT0603-IPC_A]
R32#2  1k  [FP-MCT0603-IPC_A]
U1  AMS1117-5V  [SOT229P700X180-4N]
U2  AMS1117-3V3  [SOT229P700X180-4N]

### Blocks framed on the sheet
Dual Stage Voltage Regulation: C1-C8 D4 R32#2 U1 U2

### Ports
USB_DN (bidir, see Main[1A]), USB_DP (bidir, see Main[1A]), VBAT_MON (bidir, see Main[1A])

### Nets
GND: C1.2 C2.2 C3.2 C4.2 C5.2 C6.2 C7.2 C8.2 C9.2 J1.A1(GND_A) J1.A11(RX2+) J1.A12(GND_A) J1.B1(GND_B) J1.B11(RX1+) J1.B12(GND_B) J1.SH1(SHIELD) J1.SH2(SHIELD) J1.SH3(SHIELD) J1.SH4(SHIELD) R1.2 R2.2 R5.2 R32#2.2 U1.1(GND/ADJ) U2.1(GND/ADJ)
VBAT: C1.1 C2.1 R6.2 U1.3(VIN)
VCC_3V3: C7.1 C8.1 D4.A U2.2(VOUT)
VCC_5V: C3.1 C4.1 C5.1 C6.1 D1.1(C) U1.2(VOUT) U2.3(VIN)
DN: J1.A7(DN1) J1.B7(DN2) R4.2
DP: J1.A6(DP1) J1.B6(DP2) R3.2
USB2_N: R3.1 ; port USB_DP
USB2_P: R4.1 ; port USB_DN
VBAT_MON: C9.1 R5.1 R6.1 ; port VBAT_MON
VBUS: D1.2(A) J1.A4(VBUS_A) J1.A9(VBUS_A) J1.B4(VBUS_B) J1.B9(VBUS_B)
NetD4_C: D4.C R32#2.1
NetJ1_A5: J1.A5(CC1) R1.1
NetJ1_B5: J1.B5(CC2) R2.1

Not connected (* = marked no-connect by the designer): J1 A2(TX1+)* A3(TX1-)* A8(SBU1)* A10(RX2-)* B2(TX2+)* B3(TX2-)* B8(SBU2)* B10(RX1-)*

### Notes on the sheet
- USB Type C Port - Data/Power
- Voltage Monitoring
- Power Supply — Dual Stage Regulation & USB-C
- 2
- v2.0
- Emilio Guadarrama

### Library data of the parts
C1-C9 = CMP-2007-00279-2: as C19 on sheet Storage; Device Class L2: Capacitors; Temperature Range Low: -55°C; Voltage Rating: 50 V; Digikey Description: CAP CER 0.1UF 50V X7R 0805; Category: Cap; ComponentLink2Description: Datasheet; Octopart: https://octopart.com/c0805c104k5ractu-kemet-143926; RoHS: TRUE; ComponentLink2URL: https://content.kemet.com/datasheets/KEM_C1003_C0G_SMD.pdf; Temperature Characteristic: X7R; Temperature: -55°C to +125°C; Height: 0.88mm; Temperature Range High: +125°C; Device Class L1: Passive Components; Automotive: No; Lead Free: Yes; Ipc Land Pattern Name: CAPC200125X78; Device Class L3: Ceramic Capacitors; Mouser Description: Cap Ceramic 0.1uF 50V X7R 10% SMD 2.0 x 1.2 mm 125 C Paper T/R; Capacitance: 0.10 μF; Package: C0805C-DN
D1 = CMP-02539-000047-1: DIODE SCHOTTKY 2A 40V DO-214AC; RoHS Compliant: Yes
D4 = SML-LXT0805IW-TR: as D2 on sheet Pyros; SnapEDA_Link: https://www.snapeda.com/parts/SML-LXT0805IW-TR/Lumex+Opto%252FComponents+Inc./view-part/?ref=snap; Package: 0805 Lumex; Value: *; MP: SML-LXT0805IW-TR; Check_prices: https://www.snapeda.com/parts/SML-LXT0805IW-TR/Lumex+Opto%252FComponents+Inc./view-part/?ref=eda
R1-R6 R32#2 = CMP-02407-011165-1: as R23 on sheet Storage; Length: 1.55mm; Case Code (Imperial): 0603; Case/Package: 0603; Construction: Rectangular; Package Quantity: 1000; Number of Terminations: 2; Termination: SMD/SMT; Resistor Type: Thin Film; Features: Automotive AEC-Q200; Series: MCT 0603 - Precision; Max Operating Temperature: 155°C; Depth: 0.85mm; Max Power Dissipation: 125mW; Min Operating Temperature: -55°C; Width: 0.033inch; Case Code (Metric): 1608; Packaging: Tape and Reel; Weight: 6.7E-05oz; Military Standard: Not; Height: 0.022inch
U1 U2 = AMS1117-5.0: 1A LOW DROPOUT VOLTAGE REGULATOR; MF: ams; MP: AMS1117-5.0; Package: SOT-223 Seeed Technology; SnapEDA_Link: https://www.snapeda.com/parts/AMS1117-5.0/ams/view-part/?ref=snap; Check_prices: https://www.snapeda.com/parts/AMS1117-5.0/ams/view-part/?ref=eda; Availability: Not in stock; Value: *; Price: None
J1 = 2345986-1: Package: None; Price: None; Value: *; MP: 2345986-1; Availability: Unavailable

## Sheet Sensors.SchDoc
size A; SheetNumber: 4; SheetTotal: 7
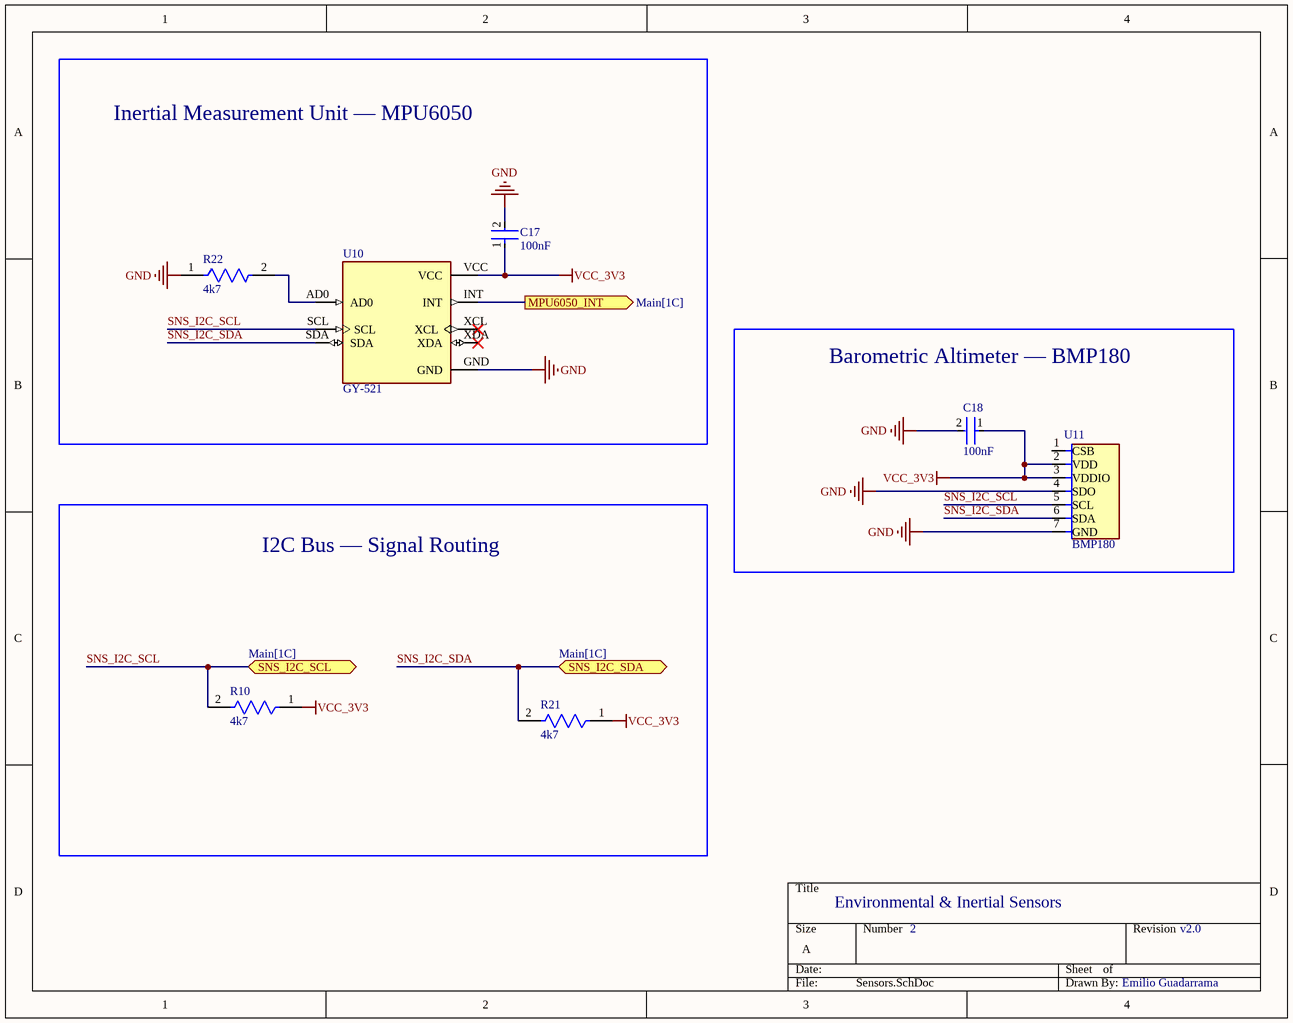
[diagram p6: Sensors.SchDoc]

### Parts
C17  100nF  [FP-C0805C-DN-MFG]
C18  100nF  [FP-C0805C-DN-MFG]
R10  4k7  [FP-MCT0603-IPC_A]
R21  4k7  [FP-MCT0603-IPC_A]
R22  4k7  [FP-MCT0603-IPC_A]
U10  GY-521  [MODULE_GY-521]
U11  BMP180  [LGA7-1.5-3.8X3.6MM]

### Blocks framed on the sheet
Inertial Measurement Unit — MPU6050: C17 R22 U10
I2C Bus — Signal Routing: R10 R21

### Ports
MPU6050_INT (out, see Main[1C]), SNS_I2C_SCL (bidir, see Main[1C]), SNS_I2C_SDA (bidir, see Main[1C])

### Nets
GND: C17.2 C18.2 R22.1 U10.GND U11.4(SDO) U11.7(GND)
VCC_3V3: C17.1 C18.1 R10.1 R21.1 U10.VCC U11.2(VDD) U11.3(VDDIO)
MPU6050_INT: U10.INT ; port MPU6050_INT
SNS_I2C_SCL: R10.2 U10.SCL U11.5(SCL) ; port SNS_I2C_SCL
SNS_I2C_SDA: R21.2 U10.SDA U11.6(SDA) ; port SNS_I2C_SDA
NetR22_2: R22.2 U10.AD0

Not connected (* = marked no-connect by the designer): U10 XCL* XDA*; U11 1(CSB)

### Notes on the sheet
- Barometric Altimeter — BMP180
- Environmental & Inertial Sensors
- 2
- v2.0
- Emilio Guadarrama

### Library data of the parts
C17 C18 = CMP-2007-00279-2: as C19 on sheet Storage; Device Class L2: Capacitors; Temperature Range Low: -55°C; Voltage Rating: 50 V; Digikey Description: CAP CER 0.1UF 50V X7R 0805; Category: Cap; ComponentLink2Description: Datasheet; Octopart: https://octopart.com/c0805c104k5ractu-kemet-143926; RoHS: TRUE; ComponentLink2URL: https://content.kemet.com/datasheets/KEM_C1003_C0G_SMD.pdf; Temperature Characteristic: X7R; Temperature: -55°C to +125°C; Height: 0.88mm; Temperature Range High: +125°C; Device Class L1: Passive Components; Automotive: No; Lead Free: Yes; Ipc Land Pattern Name: CAPC200125X78; Device Class L3: Ceramic Capacitors; Mouser Description: Cap Ceramic 0.1uF 50V X7R 10% SMD 2.0 x 1.2 mm 125 C Paper T/R; Capacitance: 0.10 μF; Package: C0805C-DN
R10 R21 R22 = CMP-02407-011165-1: as R23 on sheet Storage; Length: 1.55mm; Case Code (Imperial): 0603; Case/Package: 0603; Construction: Rectangular; Package Quantity: 1000; Number of Terminations: 2; Termination: SMD/SMT; Resistor Type: Thin Film; Features: Automotive AEC-Q200; Series: MCT 0603 - Precision; Max Operating Temperature: 155°C; Depth: 0.85mm; Max Power Dissipation: 125mW; Min Operating Temperature: -55°C; Width: 0.033inch; Case Code (Metric): 1608; Packaging: Tape and Reel; Weight: 6.7E-05oz; Military Standard: Not; Height: 0.022inch
U10 = GY-521: Triple Axis Accelerometer Gyro Breakout; MF: GODREAM FORDREAM CO., LIMITED; SnapEDA_Link: https://www.snapeda.com/parts/GY-521/GODREAM+FORDREAM+CO.%252C+LIMITED/view-part/?ref=snap; Package: Package; Value: *; MP: GY-521; Check_prices: https://www.snapeda.com/parts/GY-521/GODREAM+FORDREAM+CO.%252C+LIMITED/view-part/?ref=eda
U11 = PRESSURE-BMP180(LGA7): Pressure Sensor 4.35PSI ~ 15.95PSI (30kPa ~ 110kPa) Absolute - 16 ~ 19 b 7-VLGA; MF: Bosch; SnapEDA_Link: https://www.snapeda.com/parts/BMP180/Bosch/view-part/?ref=snap; Package: LGA-7 Bosch; Value: *; MP: BMP180; Check_prices: https://www.snapeda.com/parts/BMP180/Bosch/view-part/?ref=eda

## Nets that join several sheets
GND: Main (9 pins), Pyros (15 pins), Storage (C19.2 C20.2 J3.P6 R28.1), Indicators (11 pins), RF_LoRa_&_GPS (22 pins), Power (25 pins), Sensors (6 pins)
VBAT: Pyros (7 pins), Power (C1.1 C2.1 R6.2 U1.3)
VCC_3V3: Main (5 pins), Pyros (U5.4 U7.4), Storage (9 pins), Indicators (9 pins), RF_LoRa_&_GPS (9 pins), Power (C7.1 C8.1 D4.A U2.2), Sensors (7 pins)
VCC_5V: Indicators (LS1.N), Power (7 pins)
BUZZER: Main (MCU1.22), Indicators (R30.1)
GPS_UART_RX: Main (MCU1.11), RF_LoRa_&_GPS (R34.2)
GPS_UART_TX: Main (MCU1.10), RF_LoRa_&_GPS (R33.2)
INT_GPS: Main (MCU1.8), RF_LoRa_&_GPS (U9.18)
MPU6050_INT: Main (MCU1.17), Sensors (U10.INT)
PPS_GPS: Main (MCU1.32), RF_LoRa_&_GPS (D6.A U9.7)
PYRO_CH1_CONT: Main (MCU1.39), Pyros (R19.1 U7.3)
PYRO_CH1_GATE: Main (MCU1.4), Pyros (U8.1)
PYRO_CH2_CONT: Main (MCU1.38), Pyros (R14.1 U5.3)
PYRO_CH2_GATE: Main (MCU1.5), Pyros (U6.1)
RESET_GPS: Main (MCU1.9), RF_LoRa_&_GPS (U9.19)
RFM95W_CS: Main (MCU1.18), RF_LoRa_&_GPS (U4.5)
RFM95W_INT: Main (MCU1.7), RF_LoRa_&_GPS (U4.14)
RFM95W_RESET: Main (MCU1.12), RF_LoRa_&_GPS (U4.6)
SD_CS: Main (MCU1.34), Storage (J3.P2)
SD_DETECT: Main (MCU1.35), Storage (J3.WP R28.2)
SNS_I2C_SCL: Main (MCU1.31), Sensors (R10.2 U10.SCL U11.5)
SNS_I2C_SDA: Main (MCU1.23), Sensors (R21.2 U10.SDA U11.6)
SNS_SPI_MISO: Main (MCU1.21), Storage (J3.P7 R24.2), RF_LoRa_&_GPS (U4.2)
SNS_SPI_MOSI: Main (MCU1.19), Storage (J3.P3 R27.2), RF_LoRa_&_GPS (U4.3)
SNS_SPI_SCK: Main (MCU1.20), Storage (J3.P5 R25.2), RF_LoRa_&_GPS (U4.4)
USB2_N: Main (MCU1.13), Power (R3.1)
USB2_P: Main (MCU1.14), Power (R4.1)
VBAT_MON: Main (MCU1.15), Power (C9.1 R5.1 R6.1)
WS2812B_DATA: Main (MCU1.6), Indicators (R29.1)